# Altium schematic sheet Power.SchDoc
size A4; Organization: Altium Limited; Address1: L3, 12a Rodborough Rd; Address2: Frenchs Forest; Address3: NSW; Address4: Australia 2086; SheetNumber: 1; SheetTotal: 4
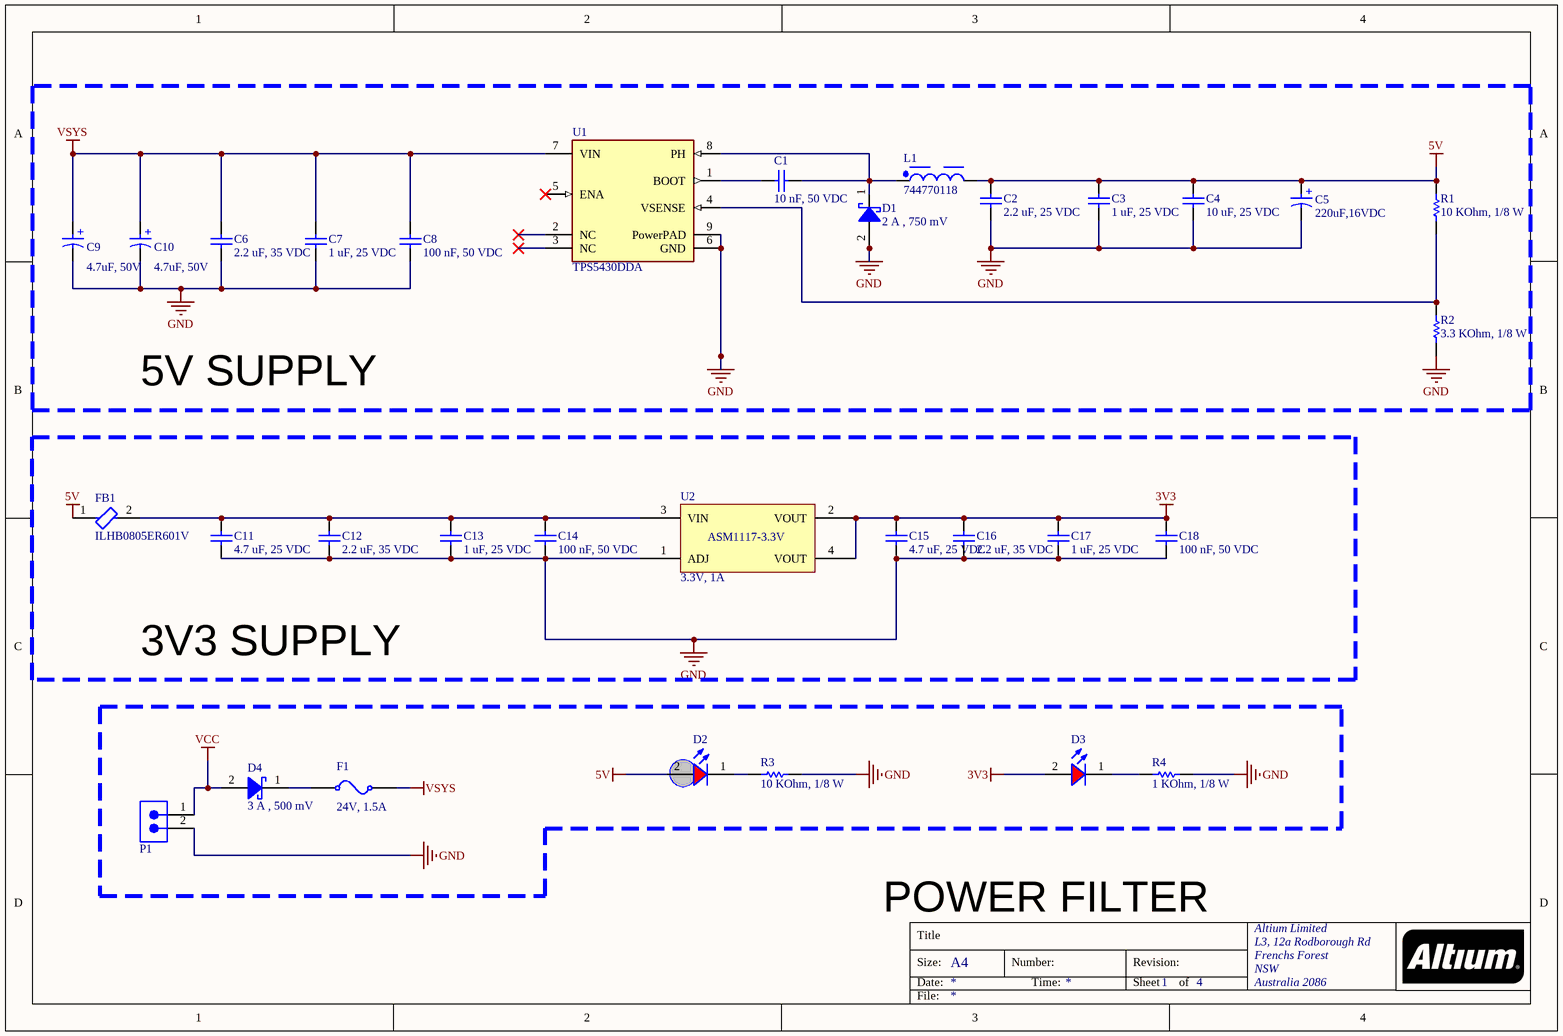
[diagram p0: Power.SchDoc]

## Parts
C1  10 nF, 50 VDC  [CAP_0805]
C2  2.2 uF, 25 VDC  [CAP_0805]
C3  1 uF, 25 VDC  [CAP_0805]
C4  10 uF, 25 VDC  [CAP_0805]
C5  220uF,16VDC  [WCAP-ASLI_D6.3H7.7]
C6  2.2 uF, 35 VDC  [CAP_0805]
C7  1 uF, 25 VDC  [CAP_0805]
C8  100 nF, 50 VDC  [CAP_0805]
C9  4.7uF, 50V  [WCAP-ASLI_D4H5.5]
C10  4.7uF, 50V  [WCAP-ASLI_D4H5.5]
C11  4.7 uF, 25 VDC  [CAP_0805]
C12  2.2 uF, 35 VDC  [CAP_0805]
C13  1 uF, 25 VDC  [CAP_0805]
C14  100 nF, 50 VDC  [CAP_0805]
C15  4.7 uF, 25 VDC  [CAP_0805]
C16  2.2 uF, 35 VDC  [CAP_0805]
C17  1 uF, 25 VDC  [CAP_0805]
C18  100 nF, 50 VDC  [CAP_0805]
D1  2 A , 750 mV  [SMA (DO-214AC)]
D2  Red, 2V  [WL-SMCW_0805]  (value not drawn)
D3  Red, 2V  [WL-SMCW_0805]  (value not drawn)
D4  3 A , 500 mV  [SMC (DO-214AB)]
F1  24V, 1.5A  [Fuse_SMD_1812]
FB1  ILHB0805ER601V  [FP-ILHB-0805-IPC_C]
L1  744770118  [WE-PD_1280]
P1  20A, 300V  [Terminal-Block 2 pin]  (value not drawn)
R1  10 KOhm, 1/8 W  [RESISTOR_0805]
R2  3.3 KOhm, 1/8 W  [RESISTOR_0805]
R3  10 KOhm, 1/8 W  [RESISTOR_0805]
R4  1 KOhm, 1/8 W  [RESISTOR_0805]
U1  TPS5430DDA  [FP-DDA0008J-MFG]
U2  3.3V, 1A  [AMS1117-3.3V SOT223]

## Blocks framed on the sheet
5V SUPPLY: C1-C10 D1 L1 R1 R2 U1
3V3 SUPPLY: C11-C18 FB1 U2

## Nets
3V3: C15.2 C16.2 C17.2 C18.2 D3.2(A) U2.2(VOUT) U2.4(VOUT)
5V: C2.2 C3.2 C4.2 C5.1(P) D2.2(A) FB1.1 L1.2 R1.2
GND: C2.1 C3.1 C4.1 C5.2(N) C6.1 C7.1 C8.1 C9.2(N) C10.2(N) C11.1 C12.1 C13.1 C14.1 C15.1 C16.1 C17.1 C18.1 D1.2(A) P1.2 R2.1 R3.1 R4.1 U1.6(GND) U1.9(PowerPAD) U2.1(ADJ)
VCC: D4.2(A) P1.1
VSYS: C6.2 C7.2 C8.2 C9.1(P) C10.1(P) F1.1 U1.7(VIN)
NetC1_1: C1.1 D1.1(K) L1.1 U1.8(PH)
NetC1_2: C1.2 U1.1(BOOT)
NetC11_2: C11.2 C12.2 C13.2 C14.2 FB1.2 U2.3(VIN)
NetD2_1: D2.1(K) R3.2
NetD3_1: D3.1(K) R4.2
NetD4_1: D4.1(K) F1.0
NetR1_1: R1.1 R2.2 U1.4(VSENSE)

Not connected (* = marked no-connect by the designer): U1 2(NC)* 3(NC)* 5(ENA)*

## Notes on the sheet
- POWER FILTER
- Title
- Size:
- Date:
- A4
- Number:
- Time:
- Revision:
- Sheet
- of
- File:
- (in symbol 865080345012) +
- (in symbol 865080640004) +
- (in symbol AMS1117-3.3V) ASM1117-3.3V

## Library data of the parts
C1 = 0108051031050: CAP, size 0805, 10 nF, 50 VDC; Manufacture Name: TDK; Manufacture SN: CGA4C2C0G1H103J060AA; Capacitance: 10 nF; Tolerance: +/-5%; Voltage Rating DC: 50 VDC; ComponentLink2Description: Datasheet; ComponentLink2URL: https://product.tdk.com/system/files/dam/doc/product/capacitor/ceramic/mlcc/catalog/mlcc_automotive_general_en.pdf?ref_disty=mouser; Operating Temperature: -55 to +125degC; Packaging: Tape and Reel; Mounting Technology: SMT; Size: 0805; Supplier 1 Name: Mouser; Supplier 1 SN: 810-CGA4C2C0G1H103J; Supplier 1 URL: https://www.mouser.vn/ProductDetail/TDK/CGA4C2C0G1H103J060AA?qs=FxQuwy19cyC9M6v0nMqjhA%3D%3D&utm_source=mouser-refine-download&utm_medium=file&utm_campaign=CGA4C2C0G1H103J060AA&utm_content=TDK; Supplier 2 Name: Digi-Key; Supplier 2 SN: 445-6947-2-ND; Supplier 2 URL: https://www.digikey.com/en/products/detail/tdk-corporation/cga4c2c0g1h103j060aa/2672840; Supplier 3 Name: thegioiic; Supplier 3 SN: OEM; Supplier 3 URL: N/A; Value: 10 nF, 50 VDC
C2 = 0108052251025: CAP, size 0805, 2.2 uF, 25 VDC; Manufacture Name: TDK; Manufacture SN: CGA4J3X7R1E225K125AD; Capacitance: 2.2 uF; Tolerance: +/-10%; Voltage Rating DC: 25 VDC; ComponentLink2Description: Datasheet; ComponentLink2URL: https://product.tdk.com/system/files/dam/doc/product/capacitor/ceramic/mlcc/catalog/mlcc_automotive_epoxy_en.pdf?ref_disty=mouser; Operating Temperature: -55 to +125degC; Packaging: Tape and Reel; Mounting Technology: SMT; Size: 0805; Supplier 1 Name: Mouser; Supplier 1 SN: 810-CGA4J3X7R1E225KD; Supplier 1 URL: https://www.mouser.vn/ProductDetail/TDK/CGA4J3X7R1E225K125AD?qs=xLDY6iXSiQZ6drRfaPQTzQ%3D%3D&utm_source=mouser-refine-download&utm_medium=file&utm_campaign=CGA4J3X7R1E225K125AD&utm_content=TDK; Supplier 2 Name: Digi-Key; Supplier 2 SN: 445-9923-2-ND; Supplier 2 URL: https://www.digikey.com/en/products/detail/tdk-corporation/cga4j3x7r1e225k125ad/3933656; Supplier 3 Name: thegioiic; Supplier 3 SN: OEM; Supplier 3 URL: N/A; Value: 2.2 uF, 25 VDC
C3 C7 C13 C17 = 0108051051025: CAP, size 0805, 1 uF, 25 VDC; Manufacture Name: TDK; Manufacture SN: CGA4J1X8R1E105K125AE; Capacitance: 1 uF; Tolerance: +/-10%; Voltage Rating DC: 25 VDC; ComponentLink2Description: Datasheet; ComponentLink2URL: https://product.tdk.com/system/files/dam/doc/product/capacitor/ceramic/mlcc/catalog/mlcc_automotive_soft_en.pdf?ref_disty=mouser; Operating Temperature: -55 to +125degC; Packaging: Tape and Reel; Mounting Technology: SMT; Size: 0805; Supplier 1 Name: Mouser; Supplier 1 SN: 810-A4J1X815K125AE; Supplier 1 URL: https://www.mouser.vn/ProductDetail/TDK/CGA4J1X8R1E105K125AE?qs=Ii670aiJhr6VRhkBsruYJg%3D%3D&utm_source=mouser-refine-download&utm_medium=file&utm_campaign=CGA4J1X8R1E105K125AE&utm_content=TDK; Supplier 2 Name: Digi-Key; Supplier 2 SN: 445-174807-2-ND; Supplier 2 URL: https://www.digikey.com/en/products/detail/tdk-corporation/cga4j1x8r1e105k125ae/6556490; Supplier 3 Name: thegioiic; Supplier 3 SN: OEM; Supplier 3 URL: N/A; Value: 1 uF, 25 VDC
C4 = 0108051061025: CAP, size 0805, 10 uF, 25 VDC; Manufacture Name: TDK; Manufacture SN: CGA4J1X7S1E106K125AE; Capacitance: 10 uF; Tolerance: +/-10%; Voltage Rating DC: 25 VDC; ComponentLink2Description: Datasheet; ComponentLink2URL: https://product.tdk.com/system/files/dam/doc/product/capacitor/ceramic/mlcc/catalog/mlcc_automotive_soft_en.pdf?ref_disty=mouser; Operating Temperature: -55 to +125degC; Packaging: Tape and Reel; Mounting Technology: SMT; Size: 0805; Supplier 1 Name: Mouser; Supplier 1 SN: 810-CGA4J1X7S1E106K2; Supplier 1 URL: https://www.mouser.vn/ProductDetail/TDK/CGA4J1X7S1E106K125AE?qs=PqoDHHvF64%252BJvhmUzM2odA%3D%3D&utm_source=mouser-refine-download&utm_medium=file&utm_campaign=CGA4J1X7S1E106K125AE&utm_content=TDK; Supplier 2 Name: Digi-Key; Supplier 2 SN: 445-181411-2-ND; Supplier 2 URL: https://www.digikey.com/en/products/detail/tdk-corporation/cga4j1x7s1e106k125ae/9744777; Supplier 3 Name: thegioiic; Supplier 3 SN: OEM; Supplier 3 URL: N/A; Value: 10 uF, 25 VDC
C5 = 865080345012: V-Chip, D6.3 x H7.7mm, 220uF, 16V; Manufacturer: Wurth Elektronik; Capacitance Tolerance: +/-20%; Dissipation Factor: 16%; Endurance: 2000h; Leakage Current: 35.2uA; Ripple Current: 275mA; Category: Aluminum Electrolytic Capacitors; ComponentLink2Description: Datasheet Link; ComponentLink2URL: https://www.we-online.com/redexpert/spec/865080345012?ad; Mount: Surface Mount; Operating Temperature Max: 105°C; Operating Temperature Min: -55°C; Packaging: Tape and Reel; Height: 7.7mm; Diameter: 6.3mm; Capacitance: 220uF; Rated Voltage (DC): 16V; Supplier 1 Name: Mouser; Supplier 1 SN: 710-865080345012; Supplier 1 URL: https://www.mouser.com/ProductDetail/Wurth-Elektronik/865080345012?qs=0KOYDY2FL28fdpLe2qFZOQ%3D%3D; Supplier 3 Name: thegioiic; Supplier 3 URL: https://www.thegioiic.com/tu-nhom-smd-220uf-16v-6-3x7-7mm; Manufacturer Part Number: N/A; Supplier 2 Name: Digi-Key; Supplier 2 SN: N/A; Supplier 2 URL: N/A; Supplier 3 SN: N/A; Value: 220uF, 16V
C6 C12 C16 = 0108052251035: CAP, size 0805, 2.2 uF, 35 VDC; Manufacture Name: TDK; Manufacture SN: CGA4J1X7R1V225K125AC; Capacitance: 2.2 uF; Tolerance: +/-10%; Voltage Rating DC: 35 VDC; ComponentLink2Description: Datasheet; ComponentLink2URL: https://product.tdk.com/system/files/dam/doc/product/capacitor/ceramic/mlcc/catalog/mlcc_automotive_general_en.pdf?ref_disty=mouser; Operating Temperature: -55 to +125degC; Packaging: Tape and Reel; Mounting Technology: SMT; Size: 0805; Supplier 1 Name: Mouser; Supplier 1 SN: 810-CGA4J1X7R1V225K; Supplier 1 URL: https://www.mouser.vn/ProductDetail/TDK/CGA4J1X7R1V225K125AC?qs=NRhsANhppD%2FTd0jz18r29g%3D%3D&utm_source=mouser-refine-download&utm_medium=file&utm_campaign=CGA4J1X7R1V225K125AC&utm_content=TDK; Supplier 2 Name: Digi-Key; Supplier 2 SN: 445-6963-2-ND; Supplier 2 URL: https://www.digikey.com/en/products/detail/tdk-corporation/cga4j1x7r1v225k125ac/2672856; Supplier 3 Name: thegioiic; Supplier 3 SN: OEM; Supplier 3 URL: N/A; Value: 2.2 uF, 35 VDC
C8 C14 C18 = 0108051041050: CAP, size 0805, 100 nF, 50 VDC; Manufacture Name: TDK; Manufacture SN: CGA4J2X8R1H104K125AD; Capacitance: 0.1 nF; Tolerance: +/-10%; Voltage Rating DC: 50 VDC; Value: 0.1 nF, 50 VDC; ComponentLink2Description: Datasheet; ComponentLink2URL: https://product.tdk.com/system/files/dam/doc/product/capacitor/ceramic/mlcc/catalog/mlcc_automotive_epoxy_en.pdf?ref_disty=mouser; Operating Temperature: -55 to +125degC; Packaging: Tape and Reel; Mounting Technology: SMT; Size: 0805; Supplier 1 Name: Mouser; Supplier 1 SN: 810-C2012X8R1H104KEP; Supplier 1 URL: https://www.mouser.vn/ProductDetail/TDK/CGA4J2X8R1H104K125AD?qs=LcTL%2F5vFEzExqZqv3rh1qQ%3D%3D&utm_source=mouser-refine-download&utm_medium=file&utm_campaign=CGA4J2X8R1H104K125AD&utm_content=TDK; Supplier 2 Name: Digi-Key; Supplier 2 SN: 445-8810-2-ND; Supplier 2 URL: https://www.digikey.com/en/products/detail/tdk-corporation/cga4j2x8r1h104k125ad/3248169; Supplier 3 Name: thegioiic; Supplier 3 SN: OEM; Supplier 3 URL: N/A
C9 C10 = 865080640004: V-Chip, D4 x H5.5mm, 4.7uF, 50V; Manufacturer: Wurth Elektronik; Capacitance Tolerance: +/-20%; Dissipation Factor: 12%; Endurance: 2000h; Leakage Current: 3uA; Ripple Current: 55mA; Category: Aluminum Electrolytic Capacitors; ComponentLink2Description: Datasheet Link; ComponentLink2URL: https://www.we-online.com/redexpert/spec/865080640004?ad; Mount: Surface Mount; Operating Temperature Max: 105°C; Operating Temperature Min: -55°C; Packaging: Tape and Reel; Height: 5.5mm; Diameter: 4mm; Capacitance: 4.7uF; Rated Voltage (DC): 50V; Supplier 1 Name: Mouser; Supplier 1 SN: 710-865080640004; Supplier 1 URL: https://www.mouser.vn/ProductDetail/Wurth-Elektronik/865080640004?qs=0KOYDY2FL2%2FjY4kqBxIvAg%3D%3D; Supplier 3 Name: thegioiic; Supplier 3 URL: https://www.thegioiic.com/product/tu-hoa-nhom?prid=6714,5972; Manufacturer Part Number: N/A; Supplier 2 Name: Digi-Key; Supplier 2 SN: N/A; Supplier 2 URL: N/A; Supplier 3 SN: N/A; Value: 4.7uF, 50V
C11 C15 = 0108054751025: CAP, size 0805, 4.7 uF, 25 VDC; Manufacture Name: TDK; Manufacture SN: CGA4J1X8L1E475K125AC; Capacitance: 4.7 uF; Tolerance: +/-10%; Voltage Rating DC: 25 VDC; ComponentLink2Description: Datasheet; ComponentLink2URL: https://product.tdk.com/system/files/dam/doc/product/capacitor/ceramic/mlcc/catalog/mlcc_automotive_hightemp_en.pdf?ref_disty=mouser; Operating Temperature: -55 to +125degC; Packaging: Tape and Reel; Mounting Technology: SMT; Size: 0805; Supplier 1 Name: Mouser; Supplier 1 SN: 810-CGA4J1X8L1E125AC; Supplier 1 URL: https://www.mouser.vn/ProductDetail/TDK/CGA4J1X8L1E475K125AC?qs=gZXFycFWdANxpKJOMQuJTA%3D%3D&utm_source=mouser-refine-download&utm_medium=file&utm_campaign=CGA4J1X8L1E475K125AC&utm_content=TDK; Supplier 2 Name: Digi-Key; Supplier 2 SN: 445-181605-2-ND; Supplier 2 URL: https://www.digikey.com/en/products/detail/tdk-corporation/cga4j1x8l1e475k125ac/9991390; Supplier 3 Name: thegioiic; Supplier 3 SN: OEM; Supplier 3 URL: N/A; Value: 4.7 uF, 25 VDC
D1 = SS26: Schottky Diodes & Rectifiers 2.0 Amp 60 Volt 40 Amp IFSM; Manufacturer: Vishay Semiconductors; Manufacturer Part Number: SS26S-E3/5AT; Forward Current: 2 A; Forward Voltage: 750 mV; Max Surge Current: 40 A; Peak Reverse Voltage: 60 V; Reverse Current: 200 uA; Type: Schottky; Supplier 1 URL: https://www.mouser.vn/ProductDetail/Vishay-General-Semiconductor/SS26S-E3-5AT?qs=tWM4QuTcS4UlRJgxN3V1tg%3D%3D; Supplier 2 URL: https://www.digikey.com/en/products/detail/vishay-general-semiconductor-diodes-division/ss26s-e3-5at/2148827; Supplier 3 URL: https://www.thegioiic.com/ss26-smb-diode-schottky-2a; Value: 2 A , 750 mV; Maximum Diode Capacitance: N/A; Power Dissipation: N/A; Recovery Time: N/A; Supplier 1: Mouser; Supplier 1 Part Number: 625-SS26S-E3/5AT; Supplier 2: Digi-Key; Supplier 2 Part Number: SS26S-E3/5ATGITR-ND; Supplier 3: thegioiic; Supplier 3 Part Number: SS26; Mount: SMD/SMT; Operating Temperature Max: + 85 C; Operating Temperature Min: - 40 C; Package / Case: SMA (DO-214AC); Packaging: Tape and Reel; ComponentLink1Description: Datasheet; ComponentLink1URL: https://www.vishay.com/doc?89055; LCSC Part #: C5350986
D2 D3 = 160805RedBlur: WL-SMCW SMT Mono-color Chip LED Blur, size 0805, Red, 2V, 140deg; Color: Red; Size: 0603; Type: Blur; ComponentLink1Description: Datasheet link; ComponentLink1URL: N/A; ComponentLink2Description: Supplier 1 URL; ComponentLink2URL: https://www.mouser.vn/ProductDetail/ams-OSRAM/LS-R976-NR-1?qs=K5ta8V%252BWhtZhvCAe1sTZFg%3D%3D; ComponentLink3Description: Supplier 2 URL; ComponentLink3URL: https://www.digikey.com/en/products/detail/lumex-opto-components-inc/SML-LXT0805IW-TR/304365; ComponentLink4Description: Supplier 3 URL; ComponentLink4URL: N/A; Supplier 1 Name: Mouser; Supplier 1 SN: 720-LSR976-NR-1; Supplier 1 URL: https://www.mouser.vn/ProductDetail/ams-OSRAM/LS-R976-NR-1?qs=K5ta8V%252BWhtZhvCAe1sTZFg%3D%3D; Supplier 2 Name: Digi-Key; Supplier 2 SN: 67-1552-2-ND; Supplier 2 URL: https://www.digikey.com/en/products/detail/lumex-opto-components-inc/SML-LXT0805IW-TR/304365; Supplier 3 Name: ICDayRoi; Supplier 3 SN: N/A; Supplier 3 URL: N/A; Value: Red, 2V
D4 = SS34: Schottky Diodes & Rectifiers 3.0 Amp 40 Volt; Manufacturer: Vishay Semiconductors; Manufacturer Part Number: SS34-E3/57T; Forward Current: 3 A; Forward Voltage: 500 mV; Max Surge Current: 100 A; Peak Reverse Voltage: 40 V; Reverse Current: 500 uA; Type: Schottky; Supplier 1 URL: https://www.mouser.vn/ProductDetail/Vishay-General-Semiconductor/SS34-E3-57T?qs=x2jpVgRnAtMC3f38kYWnRw%3D%3D; Supplier 2 URL: https://www.digikey.com/en/products/detail/vishay-general-semiconductor-diodes-division/ss34-e3-57t/1091554; Supplier 3 URL: https://www.thegioiic.com/ss34-sma-diode-schottky-3a; Value: 3 A , 500 mV; Maximum Diode Capacitance: N/A; Power Dissipation: N/A; Recovery Time: N/A; Supplier 1: Mouser; Supplier 1 Part Number: 625-SS34-E3; Supplier 2: Digi-Key; Supplier 2 Part Number: SS34-E3/57TGITR-ND; Supplier 3: thegioiic; Supplier 3 Part Number: SS34; Mount: SMD/SMT; Operating Temperature Max: + 85 C; Operating Temperature Min: - 40 C; Package / Case: SMC (DO-214AB); Packaging: Tape and Reel; ComponentLink1Description: Datasheet; ComponentLink1URL: https://www.vishay.com/doc?88751; LCSC Part #: C3008890
F1 = 061812150024: Resettable Fuse, Size 1812, 24V, 1.5A; Manufacturer: Littelfuse; Threshold Current: 20A; Trip Current: 3A; Threshold Voltage: 24V; Hold Current: 1.5A; Size: 1812; Mounting Technology: SMT/SMD; ComponentLink1Description: Datasheet link; ComponentLink1URL: https://www.littelfuse.com/~/media/electronics/product_specifications/resettable_ptcs/littelfuse_ptc_minismdc300f_2_product_specification.pdf.pdf; ComponentLink2Description: Supplier 1 URL; ComponentLink2URL: https://www.mouser.vn/ProductDetail/Littelfuse/MINISMDC150F-24-2?qs=F6FIpiMdEVZ%2Fp37J%2FDHAxA%3D%3D; ComponentLink3Description: Supplier 2 URL; ComponentLink3URL: https://www.digikey.com/en/products/detail/littelfuse-inc/MINISMDC150F-24-2/1113513?s=N4IgTCBcDaILIEkByCDKcAiBhAjAVgAYAxAejABYBaCAXQF8g; ComponentLink4Description: Supplier 3 URL; ComponentLink4URL: https://www.thegioiic.com/cau-chi-tu-phuc-hoi-1812-24v-1-5a; Supplier 1 Name: Mouser; Supplier 1 SN: 650-MINISMDC150F/24; Supplier 1 URL: https://www.mouser.vn/ProductDetail/Littelfuse/MINISMDC150F-24-2?qs=F6FIpiMdEVZ%2Fp37J%2FDHAxA%3D%3D; Supplier 2 Name: Digi-Key; Supplier 2 SN: MINISMDC150F24-2TR-ND; Supplier 2 URL: https://www.mouser.vn/ProductDetail/Littelfuse/MINISMDC150F-24-2?qs=F6FIpiMdEVZ%2Fp37J%2FDHAxA%3D%3D; Supplier 3 Name: thegioiic; Supplier 3 SN: N/A; Supplier 3 URL: https://www.thegioiic.com/cau-chi-tu-phuc-hoi-1812-24v-1-5a; Value: 24V, 1.5A
FB1 = CMP-02428-000001-1: FERRITE BEAD 600 OHM 0805 1LN; Manufacturer: Vishay; Tolerance: 25%; Shielding: true; Test Frequency: 100MHz; Impedance At Frequency: 600Ω @ 100MHz; Series Resistance: 0.1Ω; Rms Current: 2000mA; ComponentLink2URL: http://www.vishay.com/docs/34102/ilhb.pdf; Octopart: https://octopart.com/ilhb0805er601v-vishay-39650184; Automotive: No; Height: 1.1mm; Mouser Description: Ferrite Beads Multi-Layer High Current 600Ohm 25% 100MHz 2A 100mOhm DCR 0805 T/R; ComponentLink2Description: Datasheet; Device Class L2: EMI / RFI Components; Lead Free: Yes; Ipc Land Pattern Name: CAPC200125X90; Package: ILHB-0805; Manufacturer Part Number: ILHB0805ER601V; Device Class L1: Passive Components; Digikey Description: FERRITE BEAD 600 OHM 0805 1LN; Category: FBead; Temperature Range High: +125°C; Temperature: -55°C to +125°C; RoHS: TRUE; Temperature Range Low: -55°C; Device Class L3: Ferrite Beads and Chips
L1 = CMP-0227-00203-2: NexarPartId: 22866872; Inductance Tolerance: 20%; Inductance: 18µH; DC Resistance (DCR): 25mΩ; Current Rating: 5A; Self Resonant Frequency: 13.2MHz; Resistance: 32mΩ; Ambient Temperature Range Low: -40°C; Min Operating Temperature: -40°C; Ambient Temperature Range High: 85°C; Max Operating Temperature: 125°C; Height: 8mm; Packaging: Cut Tape (CT); Number of Pins: 2; Width: 12mm; Length: 12mm; RoHS: Compliant
P1 = 691312510002: Manufacturer: Wurth Elektronik; Match Code: WR-TBL; Modularity: No; Pitch: 5.08mm; ComponentLink1Description: Datasheet Link; ComponentLink1URL: https://www.we-online.com/redexpert/spec/691312510002?ad; ComponentLink2Description: Supplier 1 URL; ComponentLink2URL: N/A; Manufacturer Part Number: 691312510002; Category: Terminal Blocks; Mount: Through Hole; Operating Temperature Max: 105°C; Operating Temperature Min: -40°C; Packaging: Box; Application: Pluggable; Number of Pins: 2; Number of Rows: 1; Orientation: Horizontal; Rated Current: 20A; Working Voltage: 300V; ComponentLink3Description: Supplier 2 URL; ComponentLink3URL: N/A; ComponentLink4Description: Supplier 3 URL; ComponentLink4URL: https://www.thegioiic.com/kf-5-08-2-r-terminal-block-plug-in-han-pcb-2-chan-cong-5-08mm-300v-15a; Supplier 1 Name: Mouser; Supplier 1 SN: N/A; Supplier 1 URL: N/A; Supplier 2 Name: Digi-Key; Supplier 2 SN: N/A; Supplier 2 URL: N/A; Supplier 3 Name: thegioiic; Supplier 3 SN: N/A; Supplier 3 URL: https://www.thegioiic.com/kf-5-08-2-r-terminal-block-plug-in-han-pcb-2-chan-cong-5-08mm-300v-15a; Value: 20A, 300V
R1 = 0008051035: RES, size 0805, 10 KOhm, 1/8 W; Manufacture  Name: Vishay Dale; Manufacture  SN: CRCW080510K0JNEAC; Resistance tolerance: +/-5%; Rated Power: 1/8 W; Resistance: 10 KOhm; Size: 0805; Mounting Technology: SMT; Supplier 1 Name: Mouser; Supplier 1 SN: 71-CRCW080510K0JNEB; Supplier 1 URL: https://www.mouser.vn/ProductDetail/Vishay-Dale/CRCW080510K0JNEB?qs=LOX6nxTstiZ5fn9YUdHx5A%3D%3D; Supplier 2 Name: Digi-Key; Supplier 2 SN: 541-4163-2-ND; Supplier 2 URL: https://www.digikey.com/en/products/detail/vishay-dale/CRCW080510K0JNEAC/7928585; Supplier 3 Name: Thegioiic; Supplier 3 SN: N/A; Supplier 3 URL: N/A; Value: 10 KOhm, 1/8 W; ComponentLink1Description: Datasheet link; ComponentLink1URL: https://www.vishay.com/docs/28773/crcwce3.pdf; ComponentLink2Description: Supplier 1 URL; ComponentLink2URL: https://www.mouser.vn/ProductDetail/Vishay-Dale/CRCW080510K0JNEB?qs=LOX6nxTstiZ5fn9YUdHx5A%3D%3D; ComponentLink3Description: Supplier 2 URL; ComponentLink3URL: https://www.digikey.com/en/products/detail/vishay-dale/CRCW080510K0JNEAC/7928585; ComponentLink4Description: Supplier 3 URL; ComponentLink4URL: N/A
R2 = 0008053325: RES, size 0805, 3.3 KOhm, 1/8 W; Manufacture  Name: Panasonic; Manufacture  SN: ERJ-S06J332V; Resistance tolerance: +/-5%; Rated Power: 1/8 W; Size: 0805; Mounting Technology: SMT; Resistance: 3.3 KOhm; Supplier 1 Name: Mouser; Supplier 1 SN: 667-ERJ-S06J332V; Supplier 1 URL: https://www.mouser.vn/ProductDetail/Panasonic/ERJ-S06J332V?qs=Lnc17S3XxqC89pwdWk%2FMHQ%3D%3D; Supplier 2 Name: Digi-Key; Supplier 2 SN: P3.3KATR-ND - Tape & Reel (TR); Supplier 2 URL: https://www.digikey.com/en/products/detail/panasonic-electronic-components/ERJ-6GEYJ332V/83038; Supplier 3 Name: Thegioiic; Supplier 3 SN: N/A; Supplier 3 URL: https://www.thegioiic.com/dien-tro-3-3-kohm-0805-5; Value: 3.3 KOhm, 1/8 W; ComponentLink1Description: Datasheet link; ComponentLink1URL: https://www.mouser.vn/datasheet/2/315/AOA0000C334-1314047.pdf; ComponentLink2Description: Supplier 1 URL; ComponentLink2URL: https://www.mouser.vn/ProductDetail/Panasonic/ERJ-S06J332V?qs=Lnc17S3XxqC89pwdWk%2FMHQ%3D%3D; ComponentLink3Description: Supplier 2 URL; ComponentLink3URL: https://www.digikey.com/en/products/detail/panasonic-electronic-components/ERJ-6GEYJ332V/83038; ComponentLink4Description: Supplier 3 URL; ComponentLink4URL: https://www.thegioiic.com/dien-tro-3-3-kohm-0805-5
R3 = 0008051031: RES, size 0805, 10 KOhm, 1/8 W; Resistance tolerance: +/-1%; Rated Power: 1/8 W; Resistance: 10 KOhm; Size: 0805; Mounting Technology: SMT; Supplier 1 Name: Mouser; Supplier 1 SN: N/A; Supplier 1 URL: N/A; Supplier 2 Name: Digi-Key; Supplier 2 SN: N/A; Supplier 2 URL: N/A; Supplier 3 Name: Thegioiic; Supplier 3 SN: N/A; Supplier 3 URL: https://www.thegioiic.com/dien-tro-1-kohm-0805-1; Manufacture  Name: N/A; Manufacture  SN: N/A; Value: 10 KOhm, 1/8 W; ComponentLink1Description: Datasheet link; ComponentLink1URL: N/A; ComponentLink2Description: Supplier 1 URL; ComponentLink2URL: N/A; ComponentLink3Description: Supplier 2 URL; ComponentLink3URL: N/A; ComponentLink4Description: Supplier 3 URL; ComponentLink4URL: https://www.thegioiic.com/dien-tro-1-kohm-0805-1
R4 = 0008051025: RES, size 0805, 1 KOhm, 1/8 W; Manufacture  Name: Vishay Dale; Manufacture  SN: CRCW08051K00JNEAC; Resistance tolerance: +/-5%; Rated Power: 1/8 W; Resistance: 1 KOhm; Size: 0805; Mounting Technology: SMT; Supplier 1 Name: Mouser; Supplier 1 SN: 71-CRCW08051K00JNEC; Supplier 1 URL: https://www.mouser.vn/ProductDetail/Vishay-Dale/CRCW08051K00JNEC?qs=OW6ROCK%252BaiZqKFsNe9zjFw%3D%3D; Supplier 2 Name: Digi-Key; Supplier 2 SN: 541-4162-2-ND; Supplier 2 URL: https://www.digikey.com/en/products/detail/vishay-dale/CRCW08051K00JNEAC/7928584; Supplier 3 Name: Thegioiic; Supplier 3 SN: N/A; Supplier 3 URL: https://www.thegioiic.com/dien-tro-1-kohm-0805-5-; Value: 1 KOhm, 1/8 W; ComponentLink1Description: Datasheet link; ComponentLink1URL: https://www.vishay.com/docs/28773/crcwce3.pdf; ComponentLink2Description: Supplier 1 URL; ComponentLink2URL: https://www.mouser.vn/ProductDetail/Vishay-Dale/CRCW08051K00JNEC?qs=OW6ROCK%252BaiZqKFsNe9zjFw%3D%3D; ComponentLink3Description: Supplier 2 URL; ComponentLink3URL: https://www.digikey.com/en/products/detail/vishay-dale/CRCW08051K00JNEAC/7928584; ComponentLink4Description: Supplier 3 URL; ComponentLink4URL: https://www.thegioiic.com/dien-tro-1-kohm-0805-5-
U1 = CMP-2000-04960-2: IC REG BUCK ADJUSTABLE 3A 8SOPWR; Manufacturer: Texas Instruments; Max Junction Temp: +125°C; Max Supply Voltage: 36V; Switching Frequency: 500kHz; Output Type: AdjustableProgrammable; Standoff Height: 0mm; Output Voltage: 1.23-31V; Max Duty Cycle: 89%; Nominal Supply Current: 3mA; Min Supply Voltage: 5.5V; Number Of Outputs: 1; Temperature: -40°C to +125°C; Temperature Range High: +125°C; Manufacturer Part Number: TPS5430DDA; Device Class L3: Voltage Regulators - Switching; Mouser Description: Voltage Regulators - Switching Regulators 5.5 to 36V Input 3A Step Dwn Converter; Switching Topology: Buck; ComponentLink2URL: http://www.ti.com/lit/ds/symlink/tps5431.pdf; ComponentLink2Description: Datasheet; Device Class L2: Power Management ICs; Device Class L1: Integrated Circuits (ICs); Digikey Description: IC REG BUCK ADJUSTABLE 3A 8SOPWR; RoHS: TRUE; Octopart: https://octopart.com/tps5430dda-texas+instruments-589977; Output Current: 3A; Automotive: No; Lead Free: Yes; Category: IC; Package: DDA0008J; Temperature Range Low: -40°C; Height: 1.7mm
U2 = AMS1117-3.3V: AMS1117-3.3V, OUT 3.3V 1A.; Manufacturer: AMS; Pad Count: 4; Voltage Input Maximum: 15V; Manufacturer Part Number: N/A; Current Input Maximum: N/A; Current Output Maximum: 1A; Supplier 1 Name: Mouser; Supplier 2 Name: Digi-Key; Supplier 3 Name: thegioiic; Voltage Output: 3.3V; Mounting Technology: SMD; ComponentLink1Description: Datasheet link; ComponentLink1URL: http://www.advanced-monolithic.com/pdf/ds1117.pdf; ComponentLink2Description: Supplier 1 URL; ComponentLink2URL: N/A; ComponentLink3Description: Supplier 2 URL; ComponentLink3URL: N/A; ComponentLink4Description: Supplier 3 URL; ComponentLink4URL: N/A; Supplier 1 SN: N/A; Supplier 1 URL: N/A; Supplier 2 SN: N/A; Supplier 2 URL: N/A; Supplier 3 SN: N/A; Supplier 3 URL: https://www.thegioiic.com/ams1117-3-3v-ic-on-ap-3-3v-1a-sot-223; Value: 3.3V, 1A